# EAGLE schematic sidefacedraft3 (EAGLE 9.6.2)
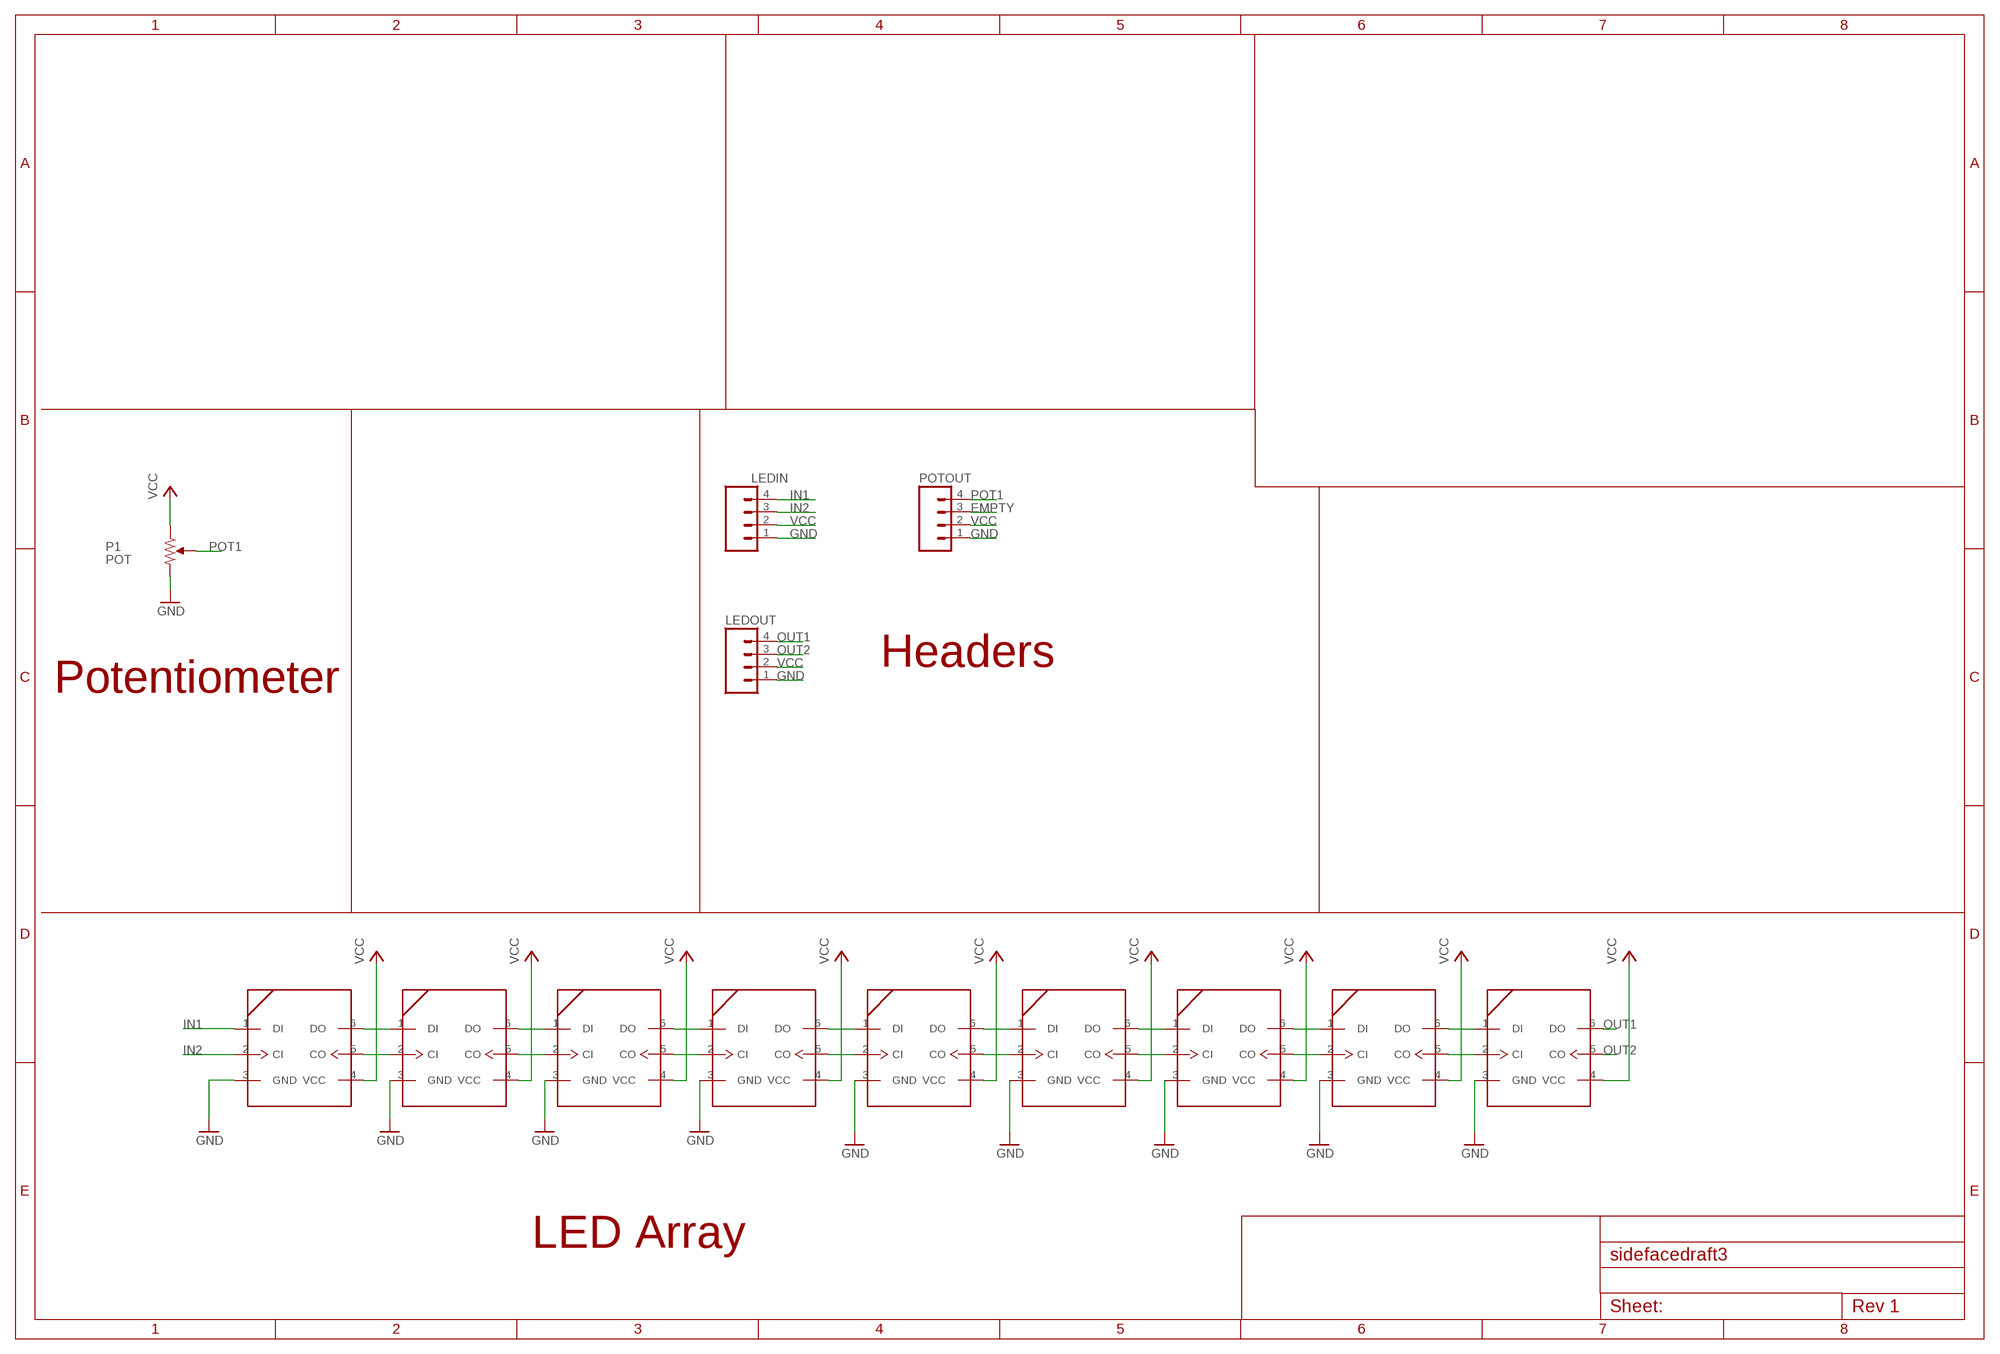
[diagram p0: schematic, sheet 1]

## Parts
LED1  APA102  [5050]
LED2  APA102  [5050]
LED3  APA102  [5050]
LED4  APA102  [5050]
LED5  APA102  [5050]
LED6  APA102  [5050]
LED7  APA102  [5050]
LED8  APA102  [5050]
LED9  APA102  [5050]
LEDIN  M04LOCK  [1X04_LOCK]
LEDOUT  M04LOCK  [1X04_LOCK]
P1  POT  [POT]
POTOUT  M04LOCK  [1X04_LOCK]

## Nets
EMPTY: POTOUT.3
GND: LED1.3(GND) LED2.3(GND) LED3.3(GND) LED4.3(GND) LED5.3(GND) LED6.3(GND) LED7.3(GND) LED8.3(GND) LED9.3(GND) LEDIN.1 LEDOUT.1 P1.GND(CW) POTOUT.1
IN1: LED1.1(DI) LEDIN.4
IN2: LED1.2(CI) LEDIN.3
N$1: LED1.6(DO) LED2.1(DI)
N$2: LED1.5(CO) LED2.2(CI)
N$3: LED2.6(DO) LED3.1(DI)
N$4: LED2.5(CO) LED3.2(CI)
N$5: LED3.6(DO) LED4.1(DI)
N$6: LED3.5(CO) LED4.2(CI)
N$9: LED4.6(DO) LED5.1(DI)
N$10: LED4.5(CO) LED5.2(CI)
N$11: LED5.6(DO) LED6.1(DI)
N$12: LED5.5(CO) LED6.2(CI)
N$13: LED6.6(DO) LED7.1(DI)
N$14: LED6.5(CO) LED7.2(CI)
N$15: LED7.6(DO) LED8.1(DI)
N$16: LED7.5(CO) LED8.2(CI)
N$17: LED8.6(DO) LED9.1(DI)
N$18: LED8.5(CO) LED9.2(CI)
OUT1: LED9.6(DO) LEDOUT.4
OUT2: LED9.5(CO) LEDOUT.3
POT1: P1.SIG(S) POTOUT.4
VCC: LED1.4(VCC) LED2.4(VCC) LED3.4(VCC) LED4.4(VCC) LED5.4(VCC) LED6.4(VCC) LED7.4(VCC) LED8.4(VCC) LED9.4(VCC) LEDIN.2 LEDOUT.2 P1.VDD(CCW) POTOUT.2

## Notes on the sheet
- Headers
- Potentiometer
- LED Array

## Library data of the parts
LED1-LED9 = ELEC327:APA102: APA102 SPI RGB LED APA102 is a chainable RGB LED. The control protocol is a variant of SPI.
LEDIN LEDOUT POTOUT = SparkFun:M04: Header 4 Standard 4-pin 0.1" header. Use with straight break away headers (SKU : PRT-00116), right angle break away headers (PRT-00553), swiss pins (PRT-00743), machine pins (PRT-00117), and female headers (PRT-00115). Molex polarized connector foot print use with SKU : PRT-08231 with associated crimp pins and housings. 1MM SMD Version SKU: PRT-10208
P1 = pot:POT